# EAGLE schematic robotsm20-linefollower (EAGLE 9.6.0)

## Sheet 1 of 4: MCU Microcontroller setup and deubg connectors.
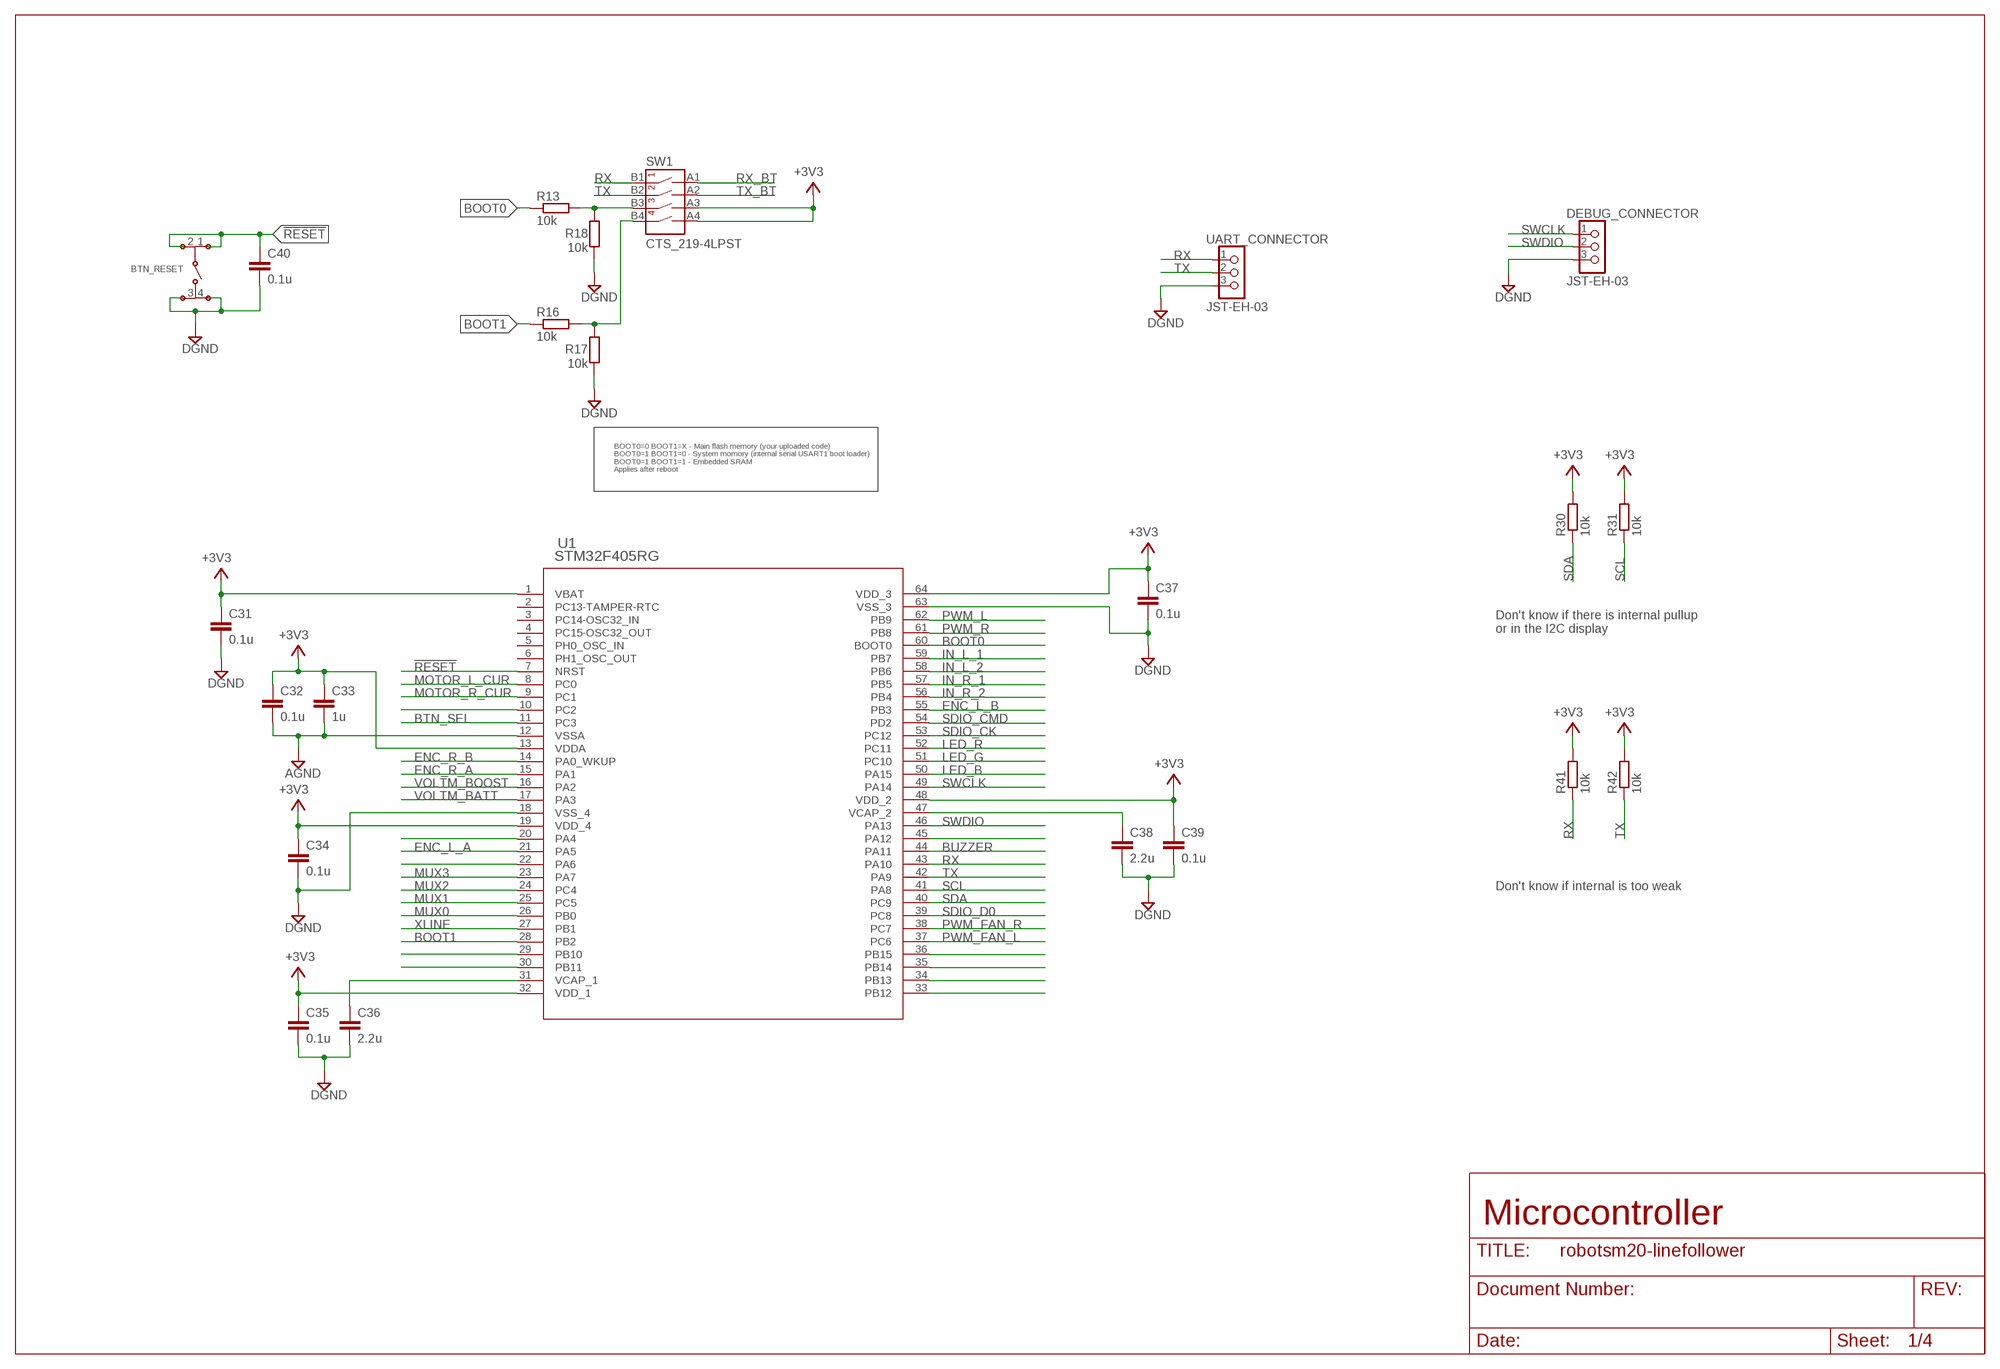
[diagram p0: schematic, sheet 1]

### Parts
BTN_RESET  TSM2JSMA  [TSM2JSMA]
C31  0.1u  C-EUC0603  [C0603]
C32  0.1u  C-EUC0603  [C0603]
C33  1u  C-EUC0603  [C0603]
C34  0.1u  C-EUC0603  [C0603]
C35  0.1u  C-EUC0603  [C0603]
C36  2.2u  C-EUC0603  [C0603]
C37  0.1u  C-EUC0603  [C0603]
C38  2.2u  C-EUC0603  [C0603]
C39  0.1u  C-EUC0603  [C0603]
C40  0.1u  C-EUC0603  [C0603]
DEBUG_CONNECTOR  JST-EH-03  EH_B3B-EH  [B3B-EH]
R13  10k  R-EU_R0603  [R0603]
R16  10k  R-EU_R0603  [R0603]
R17  10k  R-EU_R0603  [R0603]
R18  10k  R-EU_R0603  [R0603]
R30  10k  R-EU_R0603  [R0603]
R31  10k  R-EU_R0603  [R0603]
R41  10k  R-EU_R0603  [R0603]
R42  10k  R-EU_R0603  [R0603]
SW1  CTS_219-4LPST  [DIPSWITCH_4P_SMD]
U1  STM32F405RG  [LQFP-64]
UART_CONNECTOR  JST-EH-03  EH_B3B-EH  [B3B-EH]

### Nets
!RESET: BTN_RESET.1 BTN_RESET.2 C40.1 U1.7(NRST)
+3V3: C31.1 C32.1 C33.1 C34.1 C35.1 C37.1 C39.1 R30.1 R31.1 R41.1 R42.1 SW1.A3 SW1.A4 U1.1(VBAT) U1.13(VDDA) U1.19(VDD_4) U1.32(VDD_1) U1.48(VDD_2) U1.64(VDD_3) ; also sheet 2,3,4
AGND: C32.2 C33.2 U1.12(VSSA) ; also sheet 2,3,4
BOOT0: R13.2 U1.60(BOOT0)
BOOT1: R16.1 U1.28(PB2)
BTN_SEL: U1.11(PC3) ; also sheet 4
BUZZER: U1.44(PA11) ; also sheet 4
DGND: BTN_RESET.3 BTN_RESET.4 C31.2 C34.2 C35.2 C36.2 C37.2 C38.2 C39.2 C40.2 DEBUG_CONNECTOR.3 R17.1 R18.1 U1.18(VSS_4) U1.63(VSS_3) UART_CONNECTOR.3 ; also sheet 2,3,4
ENC_L_A: U1.21(PA5) ; also sheet 2
ENC_L_B: U1.55(PB3) ; also sheet 2
ENC_R_A: U1.15(PA1) ; also sheet 2
ENC_R_B: U1.14(PA0_WKUP) ; also sheet 2
IN_L_1: U1.59(PB7) ; also sheet 2
IN_L_2: U1.58(PB6) ; also sheet 2
IN_R_1: U1.57(PB5) ; also sheet 2
IN_R_2: U1.56(PB4) ; also sheet 2
LED_B: U1.50(PA15) ; also sheet 4
LED_G: U1.51(PC10) ; also sheet 4
LED_R: U1.52(PC11) ; also sheet 4
MOTOR_L_CUR: U1.8(PC0) ; also sheet 2
MOTOR_R_CUR: U1.9(PC1) ; also sheet 2
MUX0: U1.26(PB0) ; also sheet 4
MUX1: U1.25(PC5) ; also sheet 4
MUX2: U1.24(PC4) ; also sheet 4
MUX3: U1.23(PA7) ; also sheet 4
N$5: U1.36(PB15)
N$6: U1.35(PB14)
N$9: U1.34(PB13)
N$21: U1.29(PB10)
N$25: U1.20(PA4)
N$26: R16.2 R17.2 SW1.B4
N$32: U1.10(PC2)
N$34: R13.1 R18.2 SW1.B3
N$44: U1.22(PA6)
N$52: U1.30(PB11)
N$54: C36.1 U1.31(VCAP_1)
N$72: C38.1 U1.47(VCAP_2)
N$74: U1.45(PA12)
N$87: U1.33(PB12)
PWM_FAN_L: U1.37(PC6) ; also sheet 4
PWM_FAN_R: U1.38(PC7) ; also sheet 4
PWM_L: U1.62(PB9) ; also sheet 2
PWM_R: U1.61(PB8) ; also sheet 2
RX: R41.2 SW1.B1 U1.43(PA10) UART_CONNECTOR.1
RX_BT: SW1.A1 ; also sheet 4
SCL: R31.2 U1.41(PA8) ; also sheet 4
SDA: R30.2 U1.40(PC9) ; also sheet 4
SDIO_CK: U1.53(PC12) ; also sheet 4
SDIO_CMD: U1.54(PD2) ; also sheet 4
SDIO_D0: U1.39(PC8) ; also sheet 4
SWCLK: DEBUG_CONNECTOR.1 U1.49(PA14)
SWDIO: DEBUG_CONNECTOR.2 U1.46(PA13)
TX: R42.2 SW1.B2 U1.42(PA9) UART_CONNECTOR.2
TX_BT: SW1.A2 ; also sheet 4
VOLTM_BATT: U1.17(PA3) ; also sheet 4
VOLTM_BOOST: U1.16(PA2) ; also sheet 3
XLINE: U1.27(PB1) ; also sheet 4
Unconnected: U1.2(PC13-TAMPER-RTC) U1.3(PC14-OSC32_IN) U1.4(PC15-OSC32_OUT) U1.5(PH0_OSC_IN) U1.6(PH1_OSC_OUT)

### Notes on the sheet
- BOOT0=0 BOOT1=X - Main flash memory (your uploaded code)
  BOOT0=1 BOOT1=0 - System momory (internal serial USART1 boot loader) 
  BOOT0=1 BOOT1=1 - Embedded SRAM
  Applies after reboot
- Don't know if there is internal pullup
  or in the I2C display
- Don't know if internal is too weak
- Microcontroller

## Sheet 2 of 4: Motor driver A schematic over the motor driver used for the DC motors.
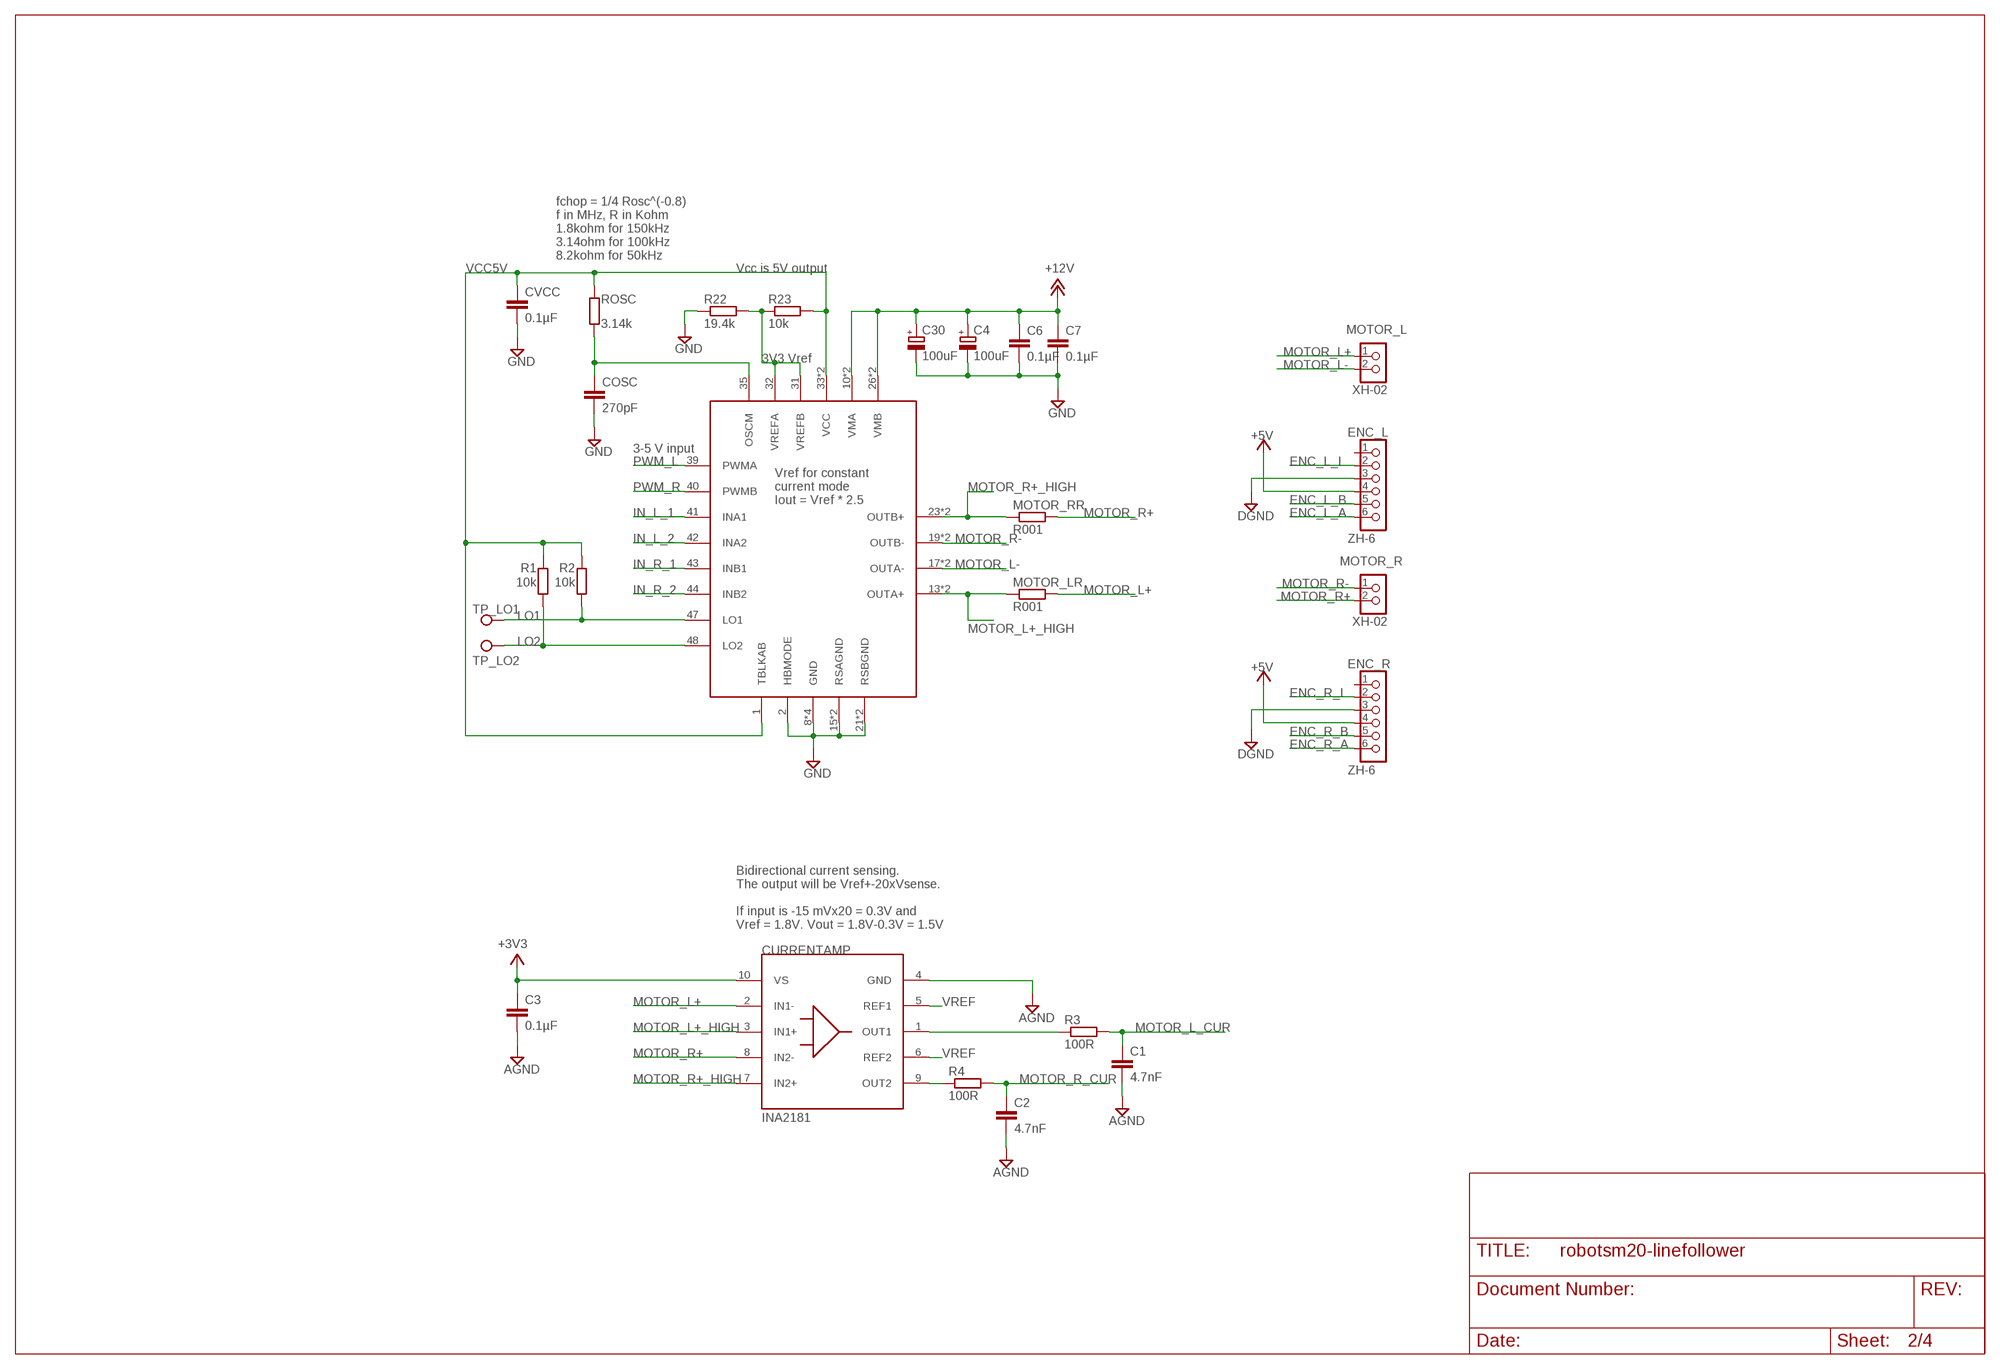
[diagram p1: schematic, sheet 2]

### Parts
C1  4.7nF  C-EUC0603  [C0603]
C2  4.7nF  C-EUC0603  [C0603]
C3  0.1µF  C-EUC0603  [C0603]
C4  100uF  WCAP-ASLL-WEWCAP-ASLL  [CAPAE660X700N]
C6  0.1µF  C-EUC0805  [C0805]
C7  0.1µF  C-EUC0805  [C0805]
C30  100uF  WCAP-ASLL-WEWCAP-ASLL  [CAPAE660X700N]
COSC  270pF  C-EUC0603  [C0603]
CURRENTAMP  INA2181  [SOP50P490X110-10N]
CVCC  0.1µF  C-EUC0603  [C0603]
ENC_L  ZH-6  ZR_B6B-ZR  [B6B-ZR]
ENC_R  ZH-6  ZR_B6B-ZR  [B6B-ZR]
MOTOR_L  XH-02  [JST-XH-02]
MOTOR_LR  R001  R-EU_R2512W  [R2512W]
MOTOR_R  XH-02  [JST-XH-02]
MOTOR_RR  R001  R-EU_R2512W  [R2512W]
MOTORDRIVER  TB67H420FTG  [QFN50P700X700X100-49T550N]
R1  10k  R-EU_R0603  [R0603]
R2  10k  R-EU_R0603  [R0603]
R3  100R  R-EU_R0603  [R0603]
R4  100R  R-EU_R0603  [R0603]
R22  19.4k  R-EU_R0603  [R0603]
R23  10k  R-EU_R0603  [R0603]
ROSC  3.14k  R-EU_R0603  [R0603]
TP_LO1  TEST-POINT3X5  [PAD.03X.05]
TP_LO2  TEST-POINT3X5  [PAD.03X.05]

### Nets
+3V3: C3.1 CURRENTAMP.10(VS) ; also sheet 1,3,4
+5V: ENC_L.4 ENC_R.4 ; also sheet 3,4
+12V: C4.1(+) C6.1 C7.1 C30.1(+) MOTORDRIVER.10(VMA) MOTORDRIVER.11(VMA) MOTORDRIVER.26(VMB) MOTORDRIVER.27(VMB) ; also sheet 3
AGND: C1.2 C2.2 C3.2 CURRENTAMP.4(GND) ; also sheet 1,3,4
DGND: ENC_L.3 ENC_R.3 ; also sheet 1,3,4
ENC_L_A: ENC_L.6 ; also sheet 1
ENC_L_B: ENC_L.5 ; also sheet 1
ENC_L_I: ENC_L.2
ENC_R_A: ENC_R.6 ; also sheet 1
ENC_R_B: ENC_R.5 ; also sheet 1
ENC_R_I: ENC_R.2
GND: C4.2(-) C6.2 C7.2 C30.2(-) COSC.2 CVCC.2 MOTORDRIVER.2(HBMODE) MOTORDRIVER.8(GND) MOTORDRIVER.15(RSAGND) MOTORDRIVER.16(RSAGND) MOTORDRIVER.21(RSBGND) MOTORDRIVER.22(RSBGND) MOTORDRIVER.29(GND) MOTORDRIVER.30(GND) MOTORDRIVER.49(GND) R22.1 ; also sheet 3,4
IN_L_1: MOTORDRIVER.41(INA1) ; also sheet 1
IN_L_2: MOTORDRIVER.42(INA2) ; also sheet 1
IN_R_1: MOTORDRIVER.43(INB1) ; also sheet 1
IN_R_2: MOTORDRIVER.44(INB2) ; also sheet 1
LO1: MOTORDRIVER.47(LO1) R2.1 TP_LO1.P$1
LO2: MOTORDRIVER.48(LO2) R1.1 TP_LO2.P$1
MOTOR_L+: CURRENTAMP.2(IN1-) MOTOR_L.1 MOTOR_LR.2
MOTOR_L+_HIGH: CURRENTAMP.3(IN1+) MOTOR_LR.1 MOTORDRIVER.13(OUTA+) MOTORDRIVER.14(OUTA+)
MOTOR_L-: MOTOR_L.2 MOTORDRIVER.17(OUTA-) MOTORDRIVER.18(OUTA-)
MOTOR_L_CUR: C1.1 R3.2 ; also sheet 1
MOTOR_R+: CURRENTAMP.8(IN2-) MOTOR_R.2 MOTOR_RR.2
MOTOR_R+_HIGH: CURRENTAMP.7(IN2+) MOTOR_RR.1 MOTORDRIVER.23(OUTB+) MOTORDRIVER.24(OUTB+)
MOTOR_R-: MOTOR_R.1 MOTORDRIVER.19(OUTB-) MOTORDRIVER.20(OUTB-)
MOTOR_R_CUR: C2.1 R4.2 ; also sheet 1
N$7: CURRENTAMP.9(OUT2) R4.1
N$8: CURRENTAMP.1(OUT1) R3.1
N$28: MOTORDRIVER.31(VREFB) MOTORDRIVER.32(VREFA) R22.2 R23.1
N$31: COSC.1 MOTORDRIVER.35(OSCM) ROSC.1
PWM_L: MOTORDRIVER.39(PWMA) ; also sheet 1
PWM_R: MOTORDRIVER.40(PWMB) ; also sheet 1
VCC5V: CVCC.1 MOTORDRIVER.1(TBLKAB) MOTORDRIVER.33(VCC) MOTORDRIVER.34(VCC) R1.2 R2.2 R23.2 ROSC.2
VREF: CURRENTAMP.5(REF1) CURRENTAMP.6(REF2) ; also sheet 3
Unconnected: ENC_L.1 ENC_R.1

### Notes on the sheet
- fchop = 1/4 Rosc^(-0.8)
  f in MHz, R in Kohm
  1.8kohm for 150kHz
  3.14ohm for 100kHz
  8.2kohm for 50kHz
- Vcc is 5V output
- 3V3 Vref
- 3-5 V input
- Vref for constant 
  current mode
  Iout = Vref * 2.5
- Bidirectional current sensing. 
  The output will be Vref+-20xVsense.
  
  If input is -15 mVx20 = 0.3V and 
  Vref = 1.8V. Vout = 1.8V-0.3V = 1.5V

## Sheet 3 of 4: Power management A schematic over the power management on the board, i.e. buck/boost etc.
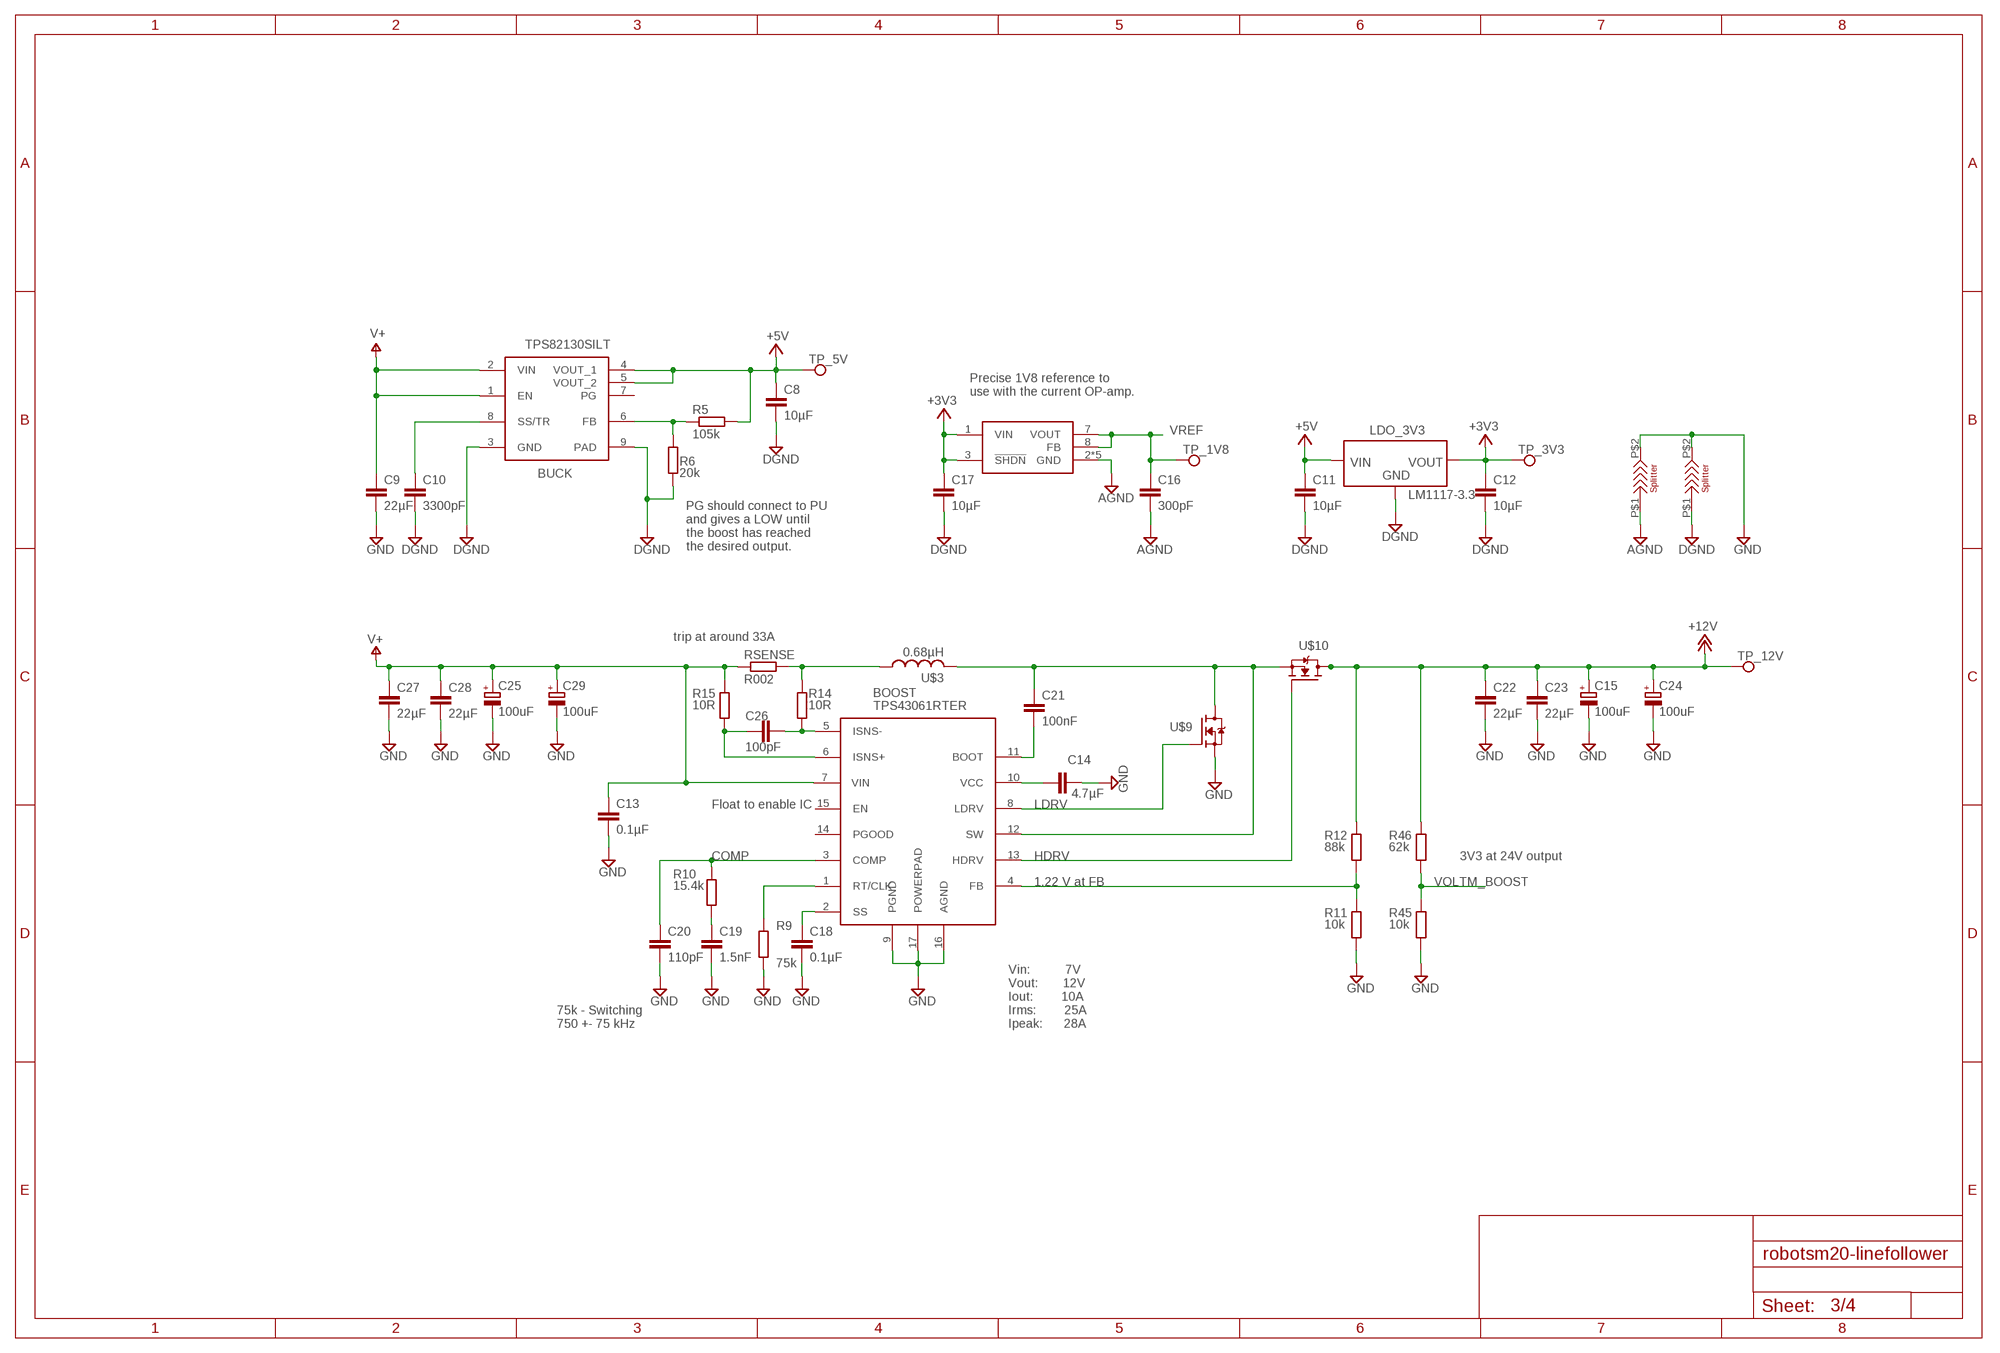
[diagram p2: schematic, sheet 3]

### Parts
BOOST  TPS43061RTER  [QFN50P300X300X80-17N]
BUCK  TPS82130SILT  [TPS82130SILT]
C8  10µF  C-EUC0603  [C0603]
C9  22µF  C-EUC0805  [C0805]
C10  3300pF  C-EUC0805  [C0805]
C11  10µF  C-EUC0603  [C0603]
C12  10µF  C-EUC0603  [C0603]
C13  0.1µF  C-EUC0805  [C0805]
C14  4.7µF  C-EUC0805  [C0805]
C15  100uF  WCAP-ASLL-WEWCAP-ASLL  [CAPAE660X700N]
C16  300pF  C-EUC0603  [C0603]
C17  10µF  C-EUC0603  [C0603]
C18  0.1µF  C-EUC0805  [C0805]
C19  1.5nF  C-EUC0805  [C0805]
C20  110pF  C-EUC0805  [C0805]
C21  100nF  C-EUC0805  [C0805]
C22  22µF  C-EUC0805  [C0805]
C23  22µF  C-EUC0805  [C0805]
C24  100uF  WCAP-ASLL-WEWCAP-ASLL  [CAPAE660X700N]
C25  100uF  WCAP-ASLL-WEWCAP-ASLL  [CAPAE660X700N]
C26  100pF  C-EUC0805  [C0805]
C27  22µF  C-EUC0805  [C0805]
C28  22µF  C-EUC0805  [C0805]
C29  100uF  WCAP-ASLL-WEWCAP-ASLL  [CAPAE660X700N]
LDO_3V3  LM1117-3.3  [SOT230P700X180-4]
LDO_VREF_1V8  MCP1501T-XXE  [SON50P200X200X80-9T80X120N]
R5  105k  R-EU_R0603  [R0603]
R6  20k  R-EU_R0603  [R0603]
R9  75k  R-EU_R0603  [R0603]
R10  15.4k  R-EU_R0603  [R0603]
R11  10k  R-EU_R0603  [R0603]
R12  88k  R-EU_R0603  [R0603]
R14  10R  R-EU_R0603  [R0603]
R15  10R  R-EU_R0603  [R0603]
R45  10k  R-EU_R0603  [R0603]
R46  62k  R-EU_R0603  [R0603]
RSENSE  R002  R-EU_R2512W  [R2512W]
TP_1V8  TEST_POINTPAD_HOLE  [PAD_HOLE]
TP_3V3  TEST_POINTPAD_HOLE  [PAD_HOLE]
TP_5V  TEST_POINTPAD_HOLE  [PAD_HOLE]
TP_12V  TEST_POINTPAD_HOLE  [PAD_HOLE]
U$3  0.68µH  SRP1238A-XXXX  [INDM135125X330N]
U$4  SPLITTER  [SPLITTER]
U$6  SPLITTER  [SPLITTER]
U$9  CSD17301Q5A  [Q5A]
U$10  CSD17301Q5A  [Q5A]

### Nets
+3V3: C12.1 C17.1 LDO_3V3.2(VOUT) LDO_3V3.4(VOUT) LDO_VREF_1V8.1(VIN) LDO_VREF_1V8.3(!SHDN!) TP_3V3.P$1 ; also sheet 1,2,4
+5V: BUCK.4(VOUT_1) BUCK.5(VOUT_2) C8.1 C11.1 LDO_3V3.3(VIN) R5.2 TP_5V.P$1 ; also sheet 2,4
+12V: C15.1(+) C22.1 C23.1 C24.1(+) R12.2 R46.2 TP_12V.P$1 U$10.5(D) U$10.6(D) U$10.7(D) U$10.8(D) U$10.9(D) ; also sheet 2
AGND: C16.2 LDO_VREF_1V8.2(GND) LDO_VREF_1V8.4(GND) LDO_VREF_1V8.5(GND) LDO_VREF_1V8.6(GND) LDO_VREF_1V8.9(GND) U$4.P$1 ; also sheet 1,2,4
COMP: BOOST.3(COMP) C20.1 R10.2
DGND: BUCK.3(GND) BUCK.9(PAD) C8.2 C10.2 C11.2 C12.2 C17.2 LDO_3V3.1(GND) R6.1 U$6.P$1 ; also sheet 1,2,4
GND: BOOST.9(PGND) BOOST.16(AGND) BOOST.17(POWERPAD) C9.2 C13.2 C14.2 C15.2(-) C18.2 C19.2 C20.2 C22.2 C23.2 C24.2(-) C25.2(-) C27.2 C28.2 C29.2(-) R9.1 R11.1 R45.1 U$4.P$2 U$6.P$2 U$9.1(S) U$9.2(S) U$9.3(S) ; also sheet 2,4
HDRV: BOOST.13(HDRV) U$10.4(G)
LDRV: BOOST.8(LDRV) U$9.4(G)
N$2: BOOST.10(VCC) C14.1
N$3: BUCK.8(SS/TR) C10.1
N$4: BUCK.6(FB) R5.1 R6.2
N$11: BOOST.1(RT/CLK) R9.2
N$12: BOOST.2(SS) C18.1
N$13: C19.1 R10.1
N$16: BOOST.11(BOOT) C21.2
N$18: R14.2 RSENSE.2 U$3.1
N$19: BOOST.12(SW) C21.1 U$3.2 U$9.5(D) U$9.6(D) U$9.7(D) U$9.8(D) U$9.9(D) U$10.1(S) U$10.2(S) U$10.3(S)
N$20: BOOST.4(FB) R11.2 R12.1
N$22: BOOST.5(ISNS-) C26.2 R14.1
N$23: BOOST.6(ISNS+) C26.1 R15.1
V+: BOOST.7(VIN) BUCK.1(EN) BUCK.2(VIN) C9.1 C13.1 C25.1(+) C27.1 C28.1 C29.1(+) R15.2 RSENSE.1 ; also sheet 4
VOLTM_BOOST: R45.2 R46.1 ; also sheet 1
VREF: C16.1 LDO_VREF_1V8.7(VOUT) LDO_VREF_1V8.8(FB) TP_1V8.P$1 ; also sheet 2
Unconnected: BOOST.14(PGOOD) BOOST.15(EN) BUCK.7(PG)

### Notes on the sheet
- Precise 1V8 reference to
  use with the current OP-amp.
- PG should connect to PU
  and gives a LOW until 
  the boost has reached 
  the desired output.
- trip at around 33A
- Float to enable IC
- 3V3 at 24V output
- 1.22 V at FB
- 75k - Switching 
  750 +- 75 kHz
- Vin:          7V
  Vout:       12V
  Iout:        10A
  Irms:        25A
  Ipeak:      28A

## Sheet 4 of 4: Peripherals Extra components such as sensors, leds, display e.t.c.
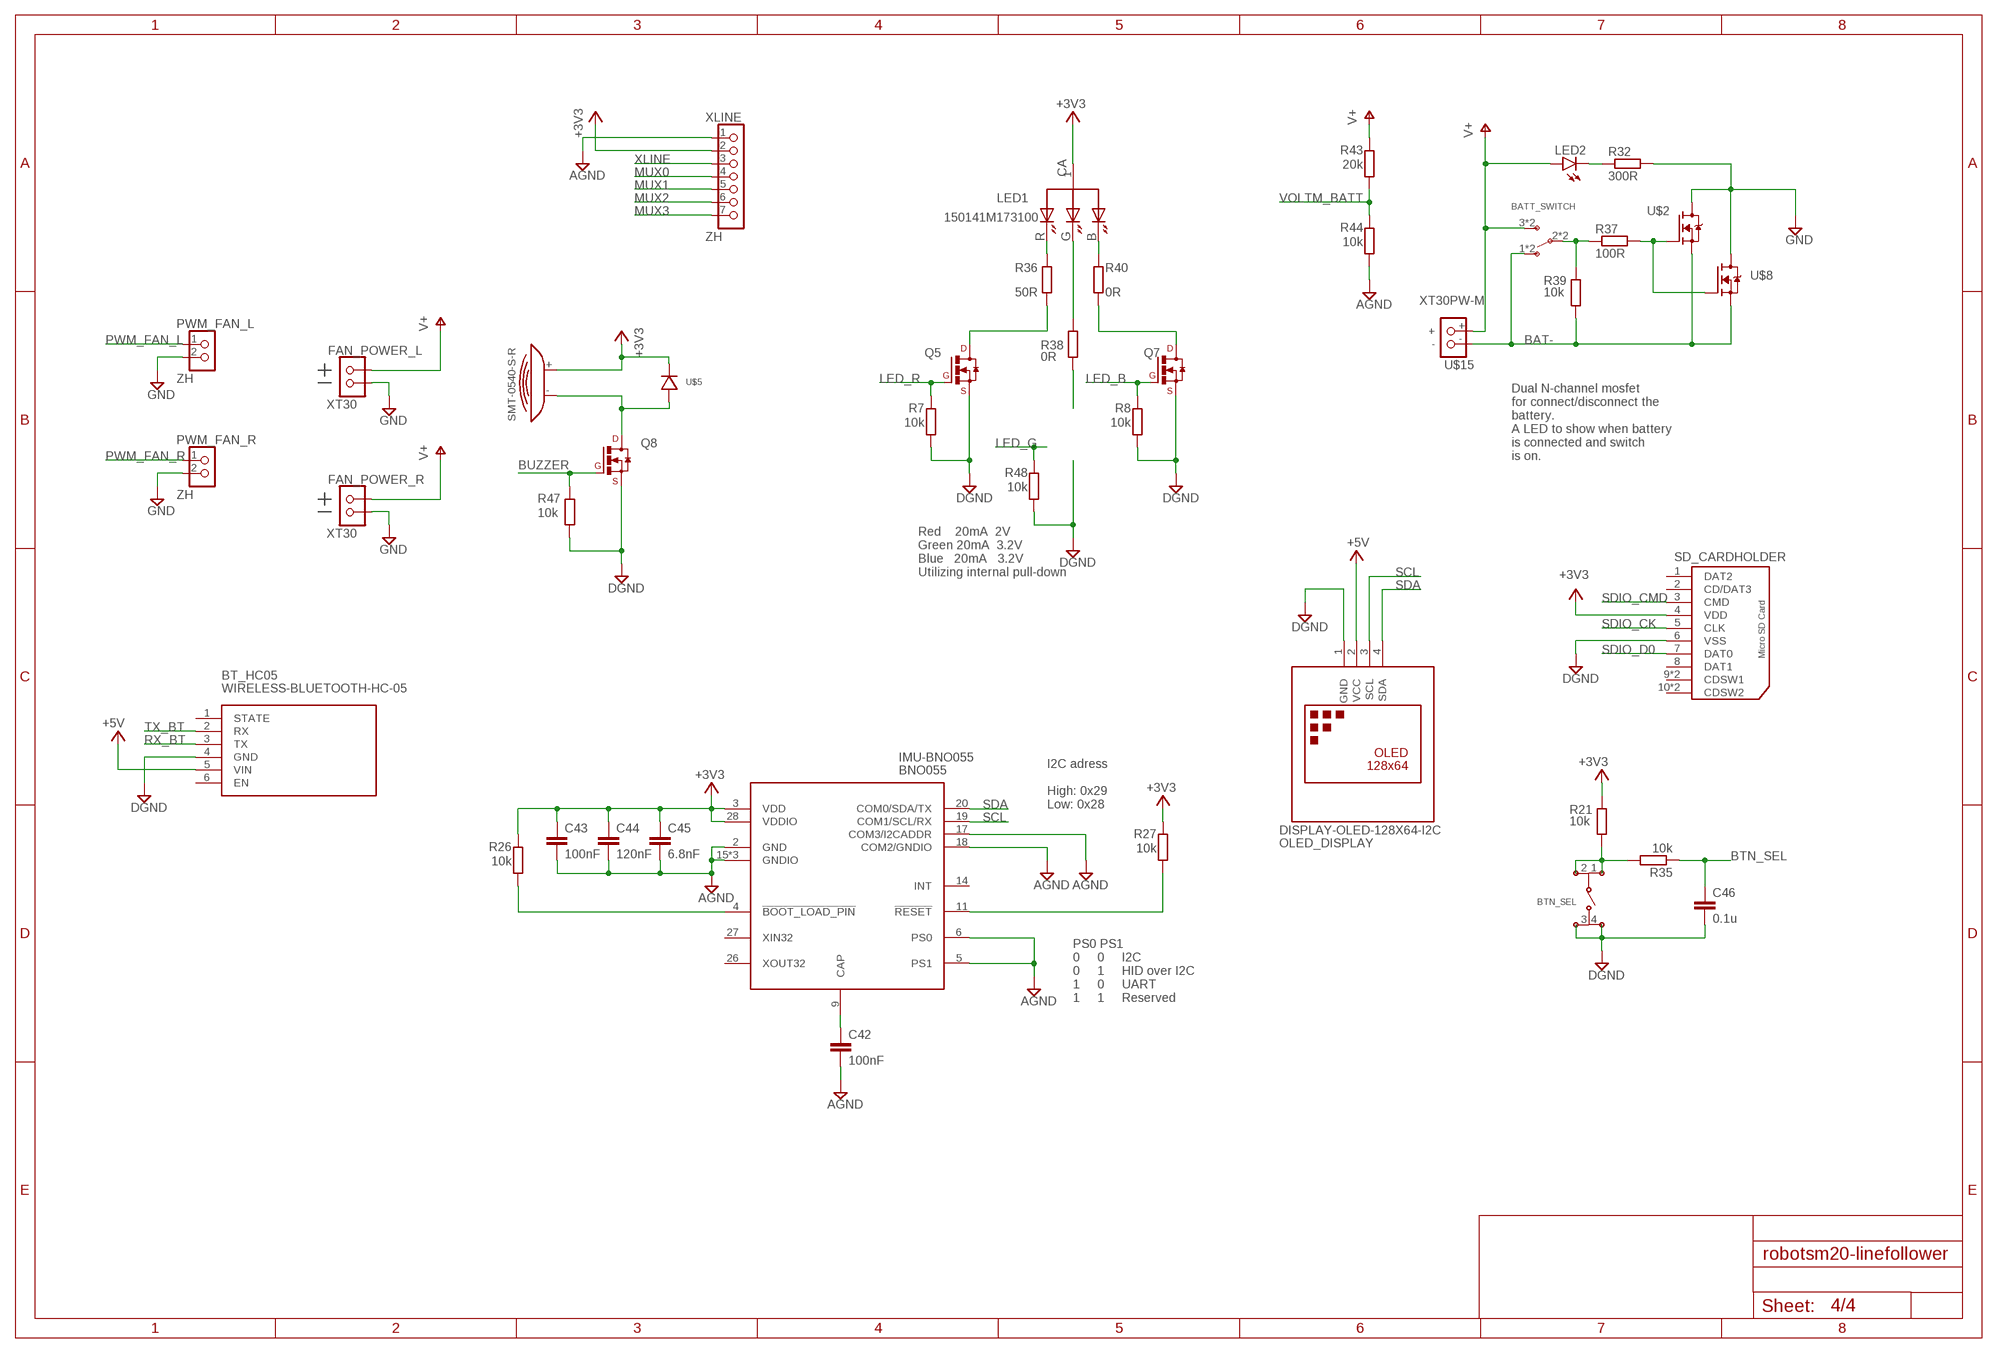
[diagram p3: schematic, sheet 4]

### Parts
BATT_SWITCH  JS202011AQN  [JS202011AQN]
BT_HC05  WIRELESS-BLUETOOTH-HC-05  [WIRELESS-BLUETOOTH-HC-05]
BTN_SEL  TSM2JSMA  [TSM2JSMA]
C42  100nF  C-EUC0603  [C0603]
C43  100nF  C-EUC0603  [C0603]
C44  120nF  C-EUC0603  [C0603]
C45  6.8nF  C-EUC0603  [C0603]
C46  0.1u  C-EUC0603  [C0603]
FAN_POWER_L  XT30  [XT30]
FAN_POWER_R  XT30  [XT30]
IMU-BNO055  BNO055  [BNO055]
LED1  150141M173100  [150141M173100]
LED2  LEDCHIPLED_0603  [CHIPLED_0603]
OLED_DISPLAY  DISPLAY-OLED-128X64-I2C  [DISPLAY-OLED-128X64-I2C]
PWM_FAN_L  ZH  ZR_B2B-ZR  [B2B-ZR]
PWM_FAN_R  ZH  ZR_B2B-ZR  [B2B-ZR]
Q5  BSS138LT3G  [SOT23]
Q7  BSS138LT3G  [SOT23]
Q8  BSS138LT3G  [SOT23]
R7  10k  R-EU_R0603  [R0603]
R8  10k  R-EU_R0603  [R0603]
R21  10k  R-EU_R0603  [R0603]
R26  10k  R-EU_R0603  [R0603]
R27  10k  R-EU_R0603  [R0603]
R32  300R  R-EU_R0603  [R0603]
R35  10k  R-EU_R0603  [R0603]
R36  50R  R-EU_R0603  [R0603]
R37  100R  R-EU_R0603  [R0603]
R38  0R  R-EU_R0603  [R0603]
R39  10k  R-EU_R0603  [R0603]
R40  0R  R-EU_R0603  [R0603]
R43  20k  R-EU_R0603  [R0603]
R44  10k  R-EU_R0603  [R0603]
R47  10k  R-EU_R0603  [R0603]
R48  10k  R-EU_R0603  [R0603]
SD_CARDHOLDER  MICRO_SD_WE_693071010811  [693071010811]
U$1  SMT-0540-S-R  [SMT-0540-S-R]
U$2  CSD17301Q5A  [Q5A]
U$5  DIODE_1N4148WX  [1N4148WX_SOD-323-2]
U$8  CSD17301Q5A  [Q5A]
U$15  XT30PW-M  [XT30PW-M]
XLINE  ZH  ZR_B7B-ZR  [B7B-ZR]

### Nets
+3V3: C43.1 C44.1 C45.1 IMU-BNO055.3(VDD) IMU-BNO055.28(VDDIO) LED1.1(CA) R21.1 R26.2 R27.2 SD_CARDHOLDER.4(VDD) U$1.+ U$5.-(-_CATHODE) XLINE.2 ; also sheet 1,2,3
+5V: BT_HC05.5(VIN) OLED_DISPLAY.2(VCC) ; also sheet 2,3
AGND: C42.2 C43.2 C44.2 C45.2 IMU-BNO055.2(GND) IMU-BNO055.5(PS1) IMU-BNO055.6(PS0) IMU-BNO055.15(GNDIO) IMU-BNO055.16(GNDIO) IMU-BNO055.17(COM3/I2CADDR) IMU-BNO055.18(COM2/GNDIO) IMU-BNO055.25(GNDIO) R44.2 XLINE.1 ; also sheet 1,2,3
BAT-: BATT_SWITCH.1(NC) BATT_SWITCH.4(NC) R39.1 U$2.1(S) U$2.2(S) U$2.3(S) U$8.1(S) U$8.2(S) U$8.3(S) U$15.-
BTN_SEL: C46.1 R35.1 ; also sheet 1
BUZZER: Q8.1(G) R47.1 ; also sheet 1
DGND: BT_HC05.4(GND) BTN_SEL.3 BTN_SEL.4 C46.2 OLED_DISPLAY.1(GND) Q5.2(S) Q7.2(S) Q8.2(S) R7.1 R8.1 R47.2 R48.1 SD_CARDHOLDER.6(VSS) ; also sheet 1,2,3
GND: FAN_POWER_L.NEG- FAN_POWER_R.NEG- PWM_FAN_L.2 PWM_FAN_R.2 R32.1 U$2.5(D) U$2.6(D) U$2.7(D) U$2.8(D) U$2.9(D) U$8.5(D) U$8.6(D) U$8.7(D) U$8.8(D) U$8.9(D) ; also sheet 2,3
LED_B: Q7.1(G) R8.2 ; also sheet 1
LED_G: R48.2 ; also sheet 1
LED_R: Q5.1(G) R7.2 ; also sheet 1
MUX0: XLINE.4 ; also sheet 1
MUX1: XLINE.5 ; also sheet 1
MUX2: XLINE.6 ; also sheet 1
MUX3: XLINE.7 ; also sheet 1
N$1: BTN_SEL.1 BTN_SEL.2 R21.2 R35.2
N$27: IMU-BNO055.11(!RESET!) R27.1
N$30: C42.1 IMU-BNO055.9(CAP)
N$33: Q8.3(D) U$1.- U$5.+(+_ANODE)
N$37: IMU-BNO055.4(!BOOT_LOAD_PIN!) R26.1
N$38: LED2.C R32.2
N$40: LED1.3(R) R36.2
N$41: R37.1 U$2.4(G) U$8.4(G)
N$42: LED1.4(G) R38.2
N$43: LED1.2(B) R40.2
N$45: Q5.3(D) R36.1
N$46: R38.1
N$47: BATT_SWITCH.2(COM) BATT_SWITCH.5(COM) R37.2 R39.2
N$48: Q7.3(D) R40.1
PWM_FAN_L: PWM_FAN_L.1 ; also sheet 1
PWM_FAN_R: PWM_FAN_R.1 ; also sheet 1
RX_BT: BT_HC05.3(TX) ; also sheet 1
SCL: IMU-BNO055.19(COM1/SCL/RX) OLED_DISPLAY.3(SCL) ; also sheet 1
SDA: IMU-BNO055.20(COM0/SDA/TX) OLED_DISPLAY.4(SDA) ; also sheet 1
SDIO_CK: SD_CARDHOLDER.5(CLK) ; also sheet 1
SDIO_CMD: SD_CARDHOLDER.3(CMD) ; also sheet 1
SDIO_D0: SD_CARDHOLDER.7(DAT0) ; also sheet 1
TX_BT: BT_HC05.2(RX) ; also sheet 1
V+: BATT_SWITCH.3(NO) BATT_SWITCH.6(NO) FAN_POWER_L.POS+ FAN_POWER_R.POS+ LED2.A R43.1 U$15.+ ; also sheet 3
VOLTM_BATT: R43.2 R44.1 ; also sheet 1
XLINE: XLINE.3 ; also sheet 1
Unconnected: BT_HC05.1(STATE) BT_HC05.6(EN) IMU-BNO055.14(INT) IMU-BNO055.26(XOUT32) IMU-BNO055.27(XIN32) SD_CARDHOLDER.1(DAT2) SD_CARDHOLDER.2(CD/DAT3) SD_CARDHOLDER.8(DAT1) SD_CARDHOLDER.9(CDSW1) SD_CARDHOLDER.9-1(CDSW1) SD_CARDHOLDER.10(CDSW2) SD_CARDHOLDER.10-1(CDSW2)

### Notes on the sheet
- Dual N-channel mosfet 
  for connect/disconnect the 
  battery.
  A LED to show when battery
  is connected and switch
  is on.
- Red    20mA  2V
  Green 20mA  3.2V
  Blue   20mA   3.2V
  Utilizing internal pull-down
- I2C adress
  
  High: 0x29
  Low: 0x28
- PS0 PS1
  0     0     I2C
  0     1     HID over I2C
  1     0     UART
  1     1     Reserved

## Library data of the parts
BATT_SWITCH = Switches:JS202011AQN: JS202011AQN ON/OFF Switch
BOOST = PowerManagement:TPS43061RTER: Low Iq, Synchronous Boost Controller with Wide Input Voltage and 5.5V Gate Drive for Low Qg NexFETs Source: Datasheet <http://www.ti.com/lit/gpn/tps43061>; DESCRIPTION: Low Iq, Synchronous Boost Controller with Wide Input Voltage and 5.5V Gate Drive for Low Qg NexFETs; HEIGHT: 0.8mm; MANUFACTURER_NAME: Texas Instruments; MANUFACTURER_PART_NUMBER: TPS43061RTER; MOUSER_PART_NUMBER: 595-TPS43061RTER; MOUSER_PRICE-STOCK: https://www.mouser.com/Search/Refine.aspx?Keyword=595-TPS43061RTER
BT_HC05 = Isaks Bibliotek:WIRELESS-BLUETOOTH-HC-05: Bluetooth Transceiver Module based on HC-05 board Tutorial is available here: https://arduino-info.wikispaces.com/BlueTooth-HC05-HC06-Modules-How-To Click here to find device on ebay.com <http://www.ebay.com/sch/hc-05+module+rs232>
BTN_RESET BTN_SEL = CASE-Switches:TSM2JSMA: FSM2JSMA Tactile SPST switches Description: C&K JS202011CQN (Vertical) and AQN (Angled) Slide DPDT switches in DIP package. Links: Datasheet <https://datasheet.octopart.com/FSM2JSMA-TE-Connectivity-datasheet-10294628.pdf> Dimensions <https://www.te.com/commerce/DocumentDelivery/DDEController?Action=showdoc&DocId=Customer+Drawing%7F2-1437565-7%7FV%7Fpdf%7FEnglish%7FENG_CD_2-1437565-7_V.pdf%7F2-1437565-7>
BUCK = PowerManagement:TPS82130SILT: 3-A 17V Step-down Converter Module with Integrated Inductor Source: Datasheet <http://www.ti.com/lit/gpn/tps82130>; DESCRIPTION: 3-A 17V Step-down Converter Module with Integrated Inductor; HEIGHT: 1mm; MANUFACTURER_NAME: Texas Instruments; MANUFACTURER_PART_NUMBER: TPS82130SILT; MOUSER_PART_NUMBER: 595-TPS82130SILT; MOUSER_PRICE-STOCK: https://www.mouser.com/Search/Refine.aspx?Keyword=595-TPS82130SILT
C1-C3 C6-C14 C16-C23 C26-C28 C31-C40 C42-C46 COSC CVCC = rcl:C-EU: CAPACITOR, European symbol; SPICEPREFIX: C
C4 C15 C24 C25 C29 C30 = Passive:WCAP-ASLL-WE
CURRENTAMP = MotorDriver:INA2181: INA2181 Dual current measure amplifier Datasheet <http://www.ti.com/general/docs/suppproductinfo.tsp?distId=26&gotoUrl=http%3A%2F%2Fwww.ti.com%2Flit%2Fds%2Fsymlink%2Fina2181.pdf> Part number Mfr: INA2181A1IDGSR Mouser: 595-INA2181A1IDGSR
DEBUG_CONNECTOR UART_CONNECTOR = CASE-JST:EH_B3B-EH: JST EH Connector, through hole, 3 pin, top entry Description: JST EH connector with 2.5 mm pitch, through hole version, 3 pin, top entry. Links: Datasheet <http://www.jst-mfg.com/product/pdf/eng/eEH.pdf>
ENC_L ENC_R = CASE-JST:ZR_B6B-ZR: JST ZR Connector, through hole, 6 pin, top entry Description: JST ZR connector with 1.5 mm pitch, through hole version, 6 pin, top entry. Links: Datasheet <http://www.jst-mfg.com/product/pdf/eng/eZH.pdf>
FAN_POWER_L FAN_POWER_R = CASE_DC-Connector:XT30: XT60 Connector Description: Common power connector for high current (60A max cont.) applications. E.g drones, electric bikes, longboards etc. Clones are known to fail durling specified load, buy genuin. Links: Geuine XT60 <https://hobbyking.com/en_us/nylon-xt60-connectors-male-female-5-pairs-genuine.html>
IMU-BNO055 = Sensors:BNO055: IMUs - Inertial Measurement Units Absolute Orientation 9-Axis Sensor Source: Datasheet <https://componentsearchengine.com/Datasheets/1/BNO055.pdf>; DESCRIPTION: IMUs - Inertial Measurement Units Absolute Orientation 9-Axis Sensor; HEIGHT: 1mm; MANUFACTURER_NAME: Bosch Sensortec; MANUFACTURER_PART_NUMBER: BNO055; MOUSER_PART_NUMBER: 262-BNO055; MOUSER_PRICE-STOCK: https://www.mouser.com/Search/Refine.aspx?Keyword=262-BNO055
LDO_3V3 = PowerManagement:LM1117-3.3: LM1117 Description: Fixed output voltage regulator Out: 3.3V, 800mA Link: Datasheet <https://datasheet.lcsc.com/szlcsc/Texas-Instruments-TI-LM1117IMPX-3-3-NOPB_C23984.pdf> LCSC.nr: C23984; IMAX: 800mA; VIN_MAX: 20; VOUT: 3.3V
LDO_VREF_1V8 = PowerManagement:MCP1501T-XXE: MCP1501T-XXE Precision Buffered Voltage Reference Datasheet <https://www.mouser.se/datasheet/2/268/20005474C-961722.pdf> Part number FOR 1.8V ref. Mfr: MCP1501T-18E/RW Mouser: 579-MCP1501T-18E/RW
LED1 = CASE-LED:150141M173100: Wurth Elektronik 150141M173100 Common Anode RGB LED Description: 150141M173100 Common Anode RGB LED from Wurth Elektronik. Links: Datasheet <https://www.mouser.se/datasheet/2/445/150141M173100-1714646.pdf>
LED2 = led:LED: LED OSRAM: - CHIPLED LG R971, LG N971, LY N971, LG Q971, LY Q971, LO R971, LY R971 LH N974, LH R974 LS Q976, LO Q976, LY Q976 LO Q996 - Hyper CHIPLED LW Q18S LB Q993, LB Q99A, LB R99A - SideLED LS A670, LO A670, LY A670, LG A670, LP A670 LB A673, LV A673, LT A673, LW A673 LH A674 LY A675 LS A676, LA A676, LO A676, LY A676, LW A676 LS A679, LY A679, LG A679 - Hyper Micro SIDELED® LS Y876, LA Y876, LO Y876, LY Y876 LT Y87S - SmartLED LW L88C, LW L88S LB L89C, LB L89S, LG L890 LS L89K, LO L89K, LY L89K LS L896, LA L896, LO L896, LY L896 - TOPLED LS T670, LO T670, LY T670, LG T670, LP T670 LSG T670, LSP T670, LSY T670, LOP T670, LYG T670 LG T671, LOG T671, LSG T671 LB T673, LV T673, LT T673, LW T673 LH T674 LS T676, LA T676, LO T676, LY T676, LB T676, LH T676, LSB T676, LW T676 LB T67C, LV T67C, LT T67C, LS T67K, LO T67K, LY T67K, LW E67C LS E67B, LA E67B, LO E67B, LY E67B, LB E67C, LV E67C, LT E67C LW T67C LS T679, LY T679, LG T679 LS T770, LO T770, LY T770, LG T770, LP T770 LB T773, LV T773, LT T773, LW T773 LH T774 LS E675, LA E675, LY E675, LS T675 LS T776, LA T776, LO T776, LY T776, LB T776 LHGB T686 LT T68C, LB T68C - Hyper Mini TOPLED® LB M676 - Mini TOPLED Santana® LG M470 LS M47K, LO M47K, LY M47K Source: http://www.osram.convergy.de LUXEON: - LUMILED® LXK2-PW12-R00, LXK2-PW12-S00, LXK2-PW14-U00, LXK2-PW14-V00 LXK2-PM12-R00, LXK2-PM12-S00, LXK2-PM14-U00 LXK2-PE12-Q00, LXK2-PE12-R00, LXK2-PE12-S00, LXK2-PE14-T00, LXK2-PE14-U00 LXK2-PB12-K00, LXK2-PB12-L00, LXK2-PB12-M00, LXK2-PB14-N00, LXK2-PB14-P00, LXK2-PB14-Q00 LXK2-PR12-L00, LXK2-PR12-M00, LXK2-PR14-Q00, LXK2-PR14-R00 LXK2-PD12-Q00, LXK2-PD12-R00, LXK2-PD12-S00 LXK2-PH12-R00, LXK2-PH12-S00 LXK2-PL12-P00, LXK2-PL12-Q00, LXK2-PL12-R00 Source: www.luxeon.com KINGBRIGHT: KA-3528ASYC Source: www.kingbright.com
MOTOR_L MOTOR_R = CASE-JST:XH-02: JST EX Connector, through hole, 2 pin, top entry Description: JST XH connector with 2.54 mm pitch, through hole version, 2 pin, top entry. Links: Datasheet <=>
MOTOR_LR MOTOR_RR R1-R18 R21-R23 R26 R27 R30-R32 R35-R48 ROSC RSENSE = rcl:R-EU_: RESISTOR, European symbol; SPICEPREFIX: R
MOTORDRIVER = MotorDriver:TB67H420FTG: TB67H420FTG Dual motor driver Datasheet <https://www.mouser.se/datasheet/2/408/TB67H420FTG_datasheet_en_20170818-1368033.pdf> Part number Mfr: TB67H420FTG,EL Mouser: 757-TB67H420FTGEL
OLED_DISPLAY = Displays:DISPLAY-OLED-128X64-I2C: OLED 128x63 - I2C - 0.96" 128x64 Dot Matrix OLED Module based on SSD1306 chip Variant with I2C interface SSD1306: datasheet <https://cdn-shop.adafruit.com/datasheets/SSD1306.pdf>
PWM_FAN_L PWM_FAN_R = CASE-JST:ZR_B2B-ZR: JST ZR Connector, through hole, 2 pin, top entry Description: JST ZR connector with 1.5 mm pitch, through hole version, 2 pin, top entry. Links: Datasheet <http://www.jst-mfg.com/product/pdf/eng/eZH.pdf>
Q5 Q7 Q8 = CASE-Transistors:BSS138LT3G: BSS138LT3G N-Channel Mosfet (SOT-23) Description: BSS138LT3G N-Channel Mosfet in a SOT-23 package Links: BSS138LT3G <http://www.farnell.com/datasheets/2353875.pdf?_ga=2.38865383.510093211.1546607516-411290609.1543318711>
SD_CARDHOLDER = Connectors:MICRO_SD_WE_693071010811: WR-CRD Micro SD Card Connector Push & Push 8 pins KIND PROPERTIES Quality Class:10000 Mating cycles Gender:Socket Type:Push & Push General Information Operating Temperature:--25 up to +85 °C; Compliance:RoHS Electrical Properties IR:0.5A Working Voltage:100V (AC) Withstanding Voltage:500V (AC) Contact Resistance:100mΩ Material Properties Insulator MateriaL:LCP Insulator Flammability Rating:UL94 V-0 Insulator Color:Black Color:Black Cover Material:Stainless Steel Contact Material:Copper Alloy Contact Plating:1 u' on contact area; Selective Gold Contact Type:Stamped Details see: https://www.we-online.de/katalog/en/CRD_SD_MICRO_PUSH_AND_PULL_8_PINS/ Created by Yingchun,Shan 2019-11-22 2019 (C) Würth Elektronik; DATASHEET-URL: https://www.we-online.com/catalog/datasheet/693071010811.pdf; GERDER: Socket; MOUNT: SMT; PART-NUMBER: 693071010811; PINS: 8; TYPE: Push & Push
SW1 = CASE-Switches:CTS_219-4LPST: 219-4LPST - Standard 4 position DIP-Switch - SMD Description: Standard 4 position DIP-Switch in SMD package. Links: Datasheet1 <https://datasheet.octopart.com/219-4LPST-CTS-Components-datasheet-5314881.pdf> RS-Components <https://se.rs-online.com/web/p/dip-sip-switches/1774357/?relevancy-data=636F3D3126696E3D4931384E525353746F636B4E756D626572266C753D656E266D6D3D6D61746368616C6C26706D3D5E2828282872737C5253295B205D3F293F285C647B337D5B5C2D5C735D3F5C647B332C347D5B705061415D3F29297C283235285C647B387D7C5C647B317D5C2D5C647B377D2929292426706F3D3126736E3D592673723D2673743D52535F53544F434B5F4E554D4245522677633D4E4F4E45267573743D3137372D34333537267374613D3137373433353726&searchHistory=%7B%22enabled%22%3Atrue%7D>
TP_1V8 TP_3V3 TP_5V TP_12V = MISC:TEST_POINT
TP_LO1 TP_LO2 = Isaks Bibliotek:TEST-POINT: Test Points Bare copper test points for troubleshooting or In-Circuit-Testing.
U1 = CASE-MCU:STM32F405RG: STM32F405RG Microcontroller Description: Arm Cortex M4 processor, 168MHz Link: DataSheet <https://www.st.com/resource/en/datasheet/stm32f405rg.pdf>
U$1 = Isaks Bibliotek:SMT-0540-S-R: Magnetic buzzer Description: SMD Link: Datasheet <http://www.puiaudio.com/pdf/SMT-0540-S-R.pdf>
U$2 U$8-U$10 = PowerManagement:CSD17301Q5A: CSD17301Q5A 30V N-channel 100A Mosfet Datasheet <http://www.ti.com/lit/ds/symlink/csd17301q5a.pdf> Part number Mfr:CSD17301Q5A Mouser: 595-CSD17301Q5A
U$3 = PowerManagement:SRP1238A-XXXX: Inductor Description: R68M: 0.68µH + 28A + 49Asat Source: Datasheet <https://www.mouser.se/datasheet/2/54/bourns_SRP1238A-1159514.pdf>
U$4 U$6 = PowerManagement:SPLITTER
U$5 = Isaks Bibliotek:DIODE_1N4148WX
U$15 = Connectors:XT30PW-M
XLINE = CASE-JST:ZR_B7B-ZR: JST ZR Connector, through hole, 7 pin, top entry Description: JST ZR connector with 1.5 mm pitch, through hole version, 7 pin, top entry. Links: Datasheet <http://www.jst-mfg.com/product/pdf/eng/eZH.pdf>